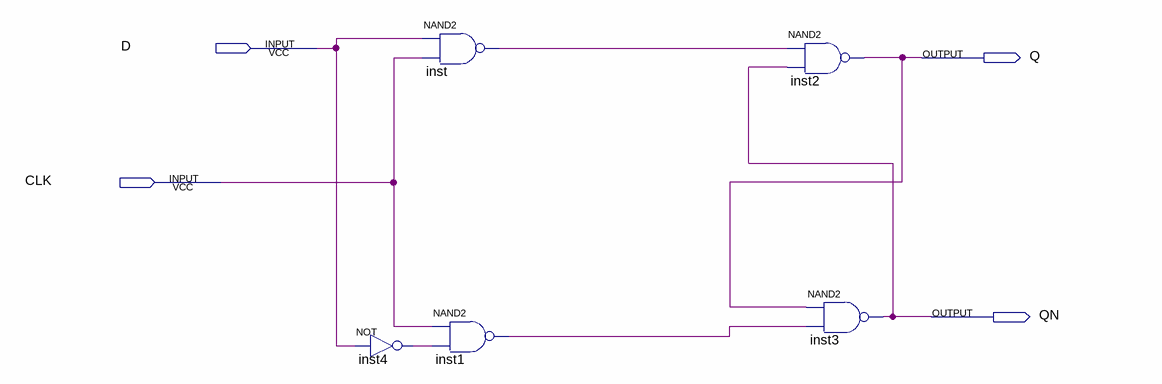
[diagram p0: schematic sheet]
// Quartus schematic lab9step2.bdf as structural Verilog: 5 symbols, 4 pins
module lab9step2 (
  input  D,
  input  CLK,
  output Q,
  output QN
);

  wire inst1_out, inst4_out, inst_out;

  not inst4 (inst4_out, D);
  nand inst (inst_out, D, CLK);
  nand inst1 (inst1_out, CLK, inst4_out);
  nand inst2 (Q, inst_out, QN);
  nand inst3 (QN, Q, inst1_out);
endmodule
